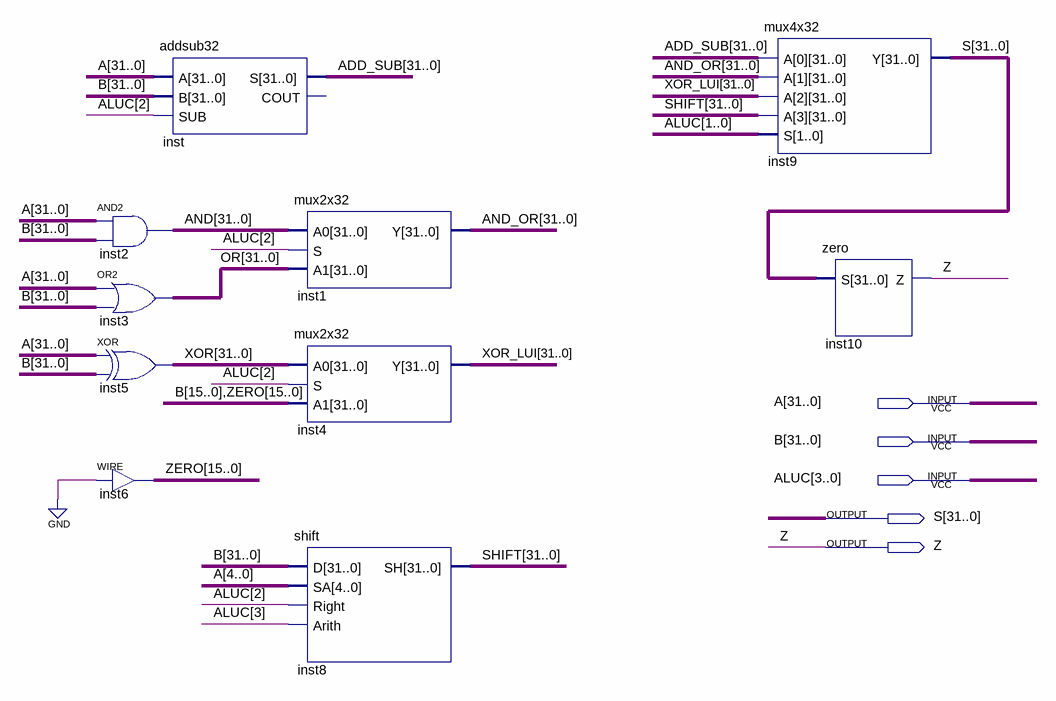
[diagram p0: schematic sheet]
// Quartus schematic ALU.bdf as structural Verilog: 10 symbols, 5 pins
module ALU (
  input  [31:0] A,
  input  [31:0] B,
  input  [3:0] ALUC,
  output [31:0] S,
  output Z
);

  wire [15:0] ZERO;
  wire [31:0] ADD_SUB, AND, AND_OR, OR, SHIFT, XOR, XOR_LUI;

  assign AND = A & B;  // AND2 inst2, 32 bits wide
  assign OR = A | B;  // OR2 inst3, 32 bits wide
  assign XOR = A ^ B;  // XOR inst5, 32 bits wide
  assign ZERO = {16{1'b0}};  // WIRE inst6
  addsub32 inst (.A(A), .B(B), .SUB(ALUC[2]), .S(ADD_SUB));  // open: COUT
  mux2x32 inst1 (.A0(AND), .S(ALUC[2]), .A1(OR), .Y(AND_OR));
  mux2x32 inst4 (.A0(XOR), .S(ALUC[2]), .A1({B[15:0], ZERO}), .Y(XOR_LUI));
  shift inst8 (.D(B), .SA(A[4:0]), .Right(ALUC[2]), .Arith(ALUC[3]), .SH(SHIFT));
  mux4x32 inst9 (.A_0(ADD_SUB), .A_1(AND_OR), .A_2(XOR_LUI), .A_3(SHIFT), .S(ALUC[1:0]), .Y(S));
  zero inst10 (.S(S), .Z(Z));
endmodule
